# EAGLE design PiHat (EAGLE 9.6.2)
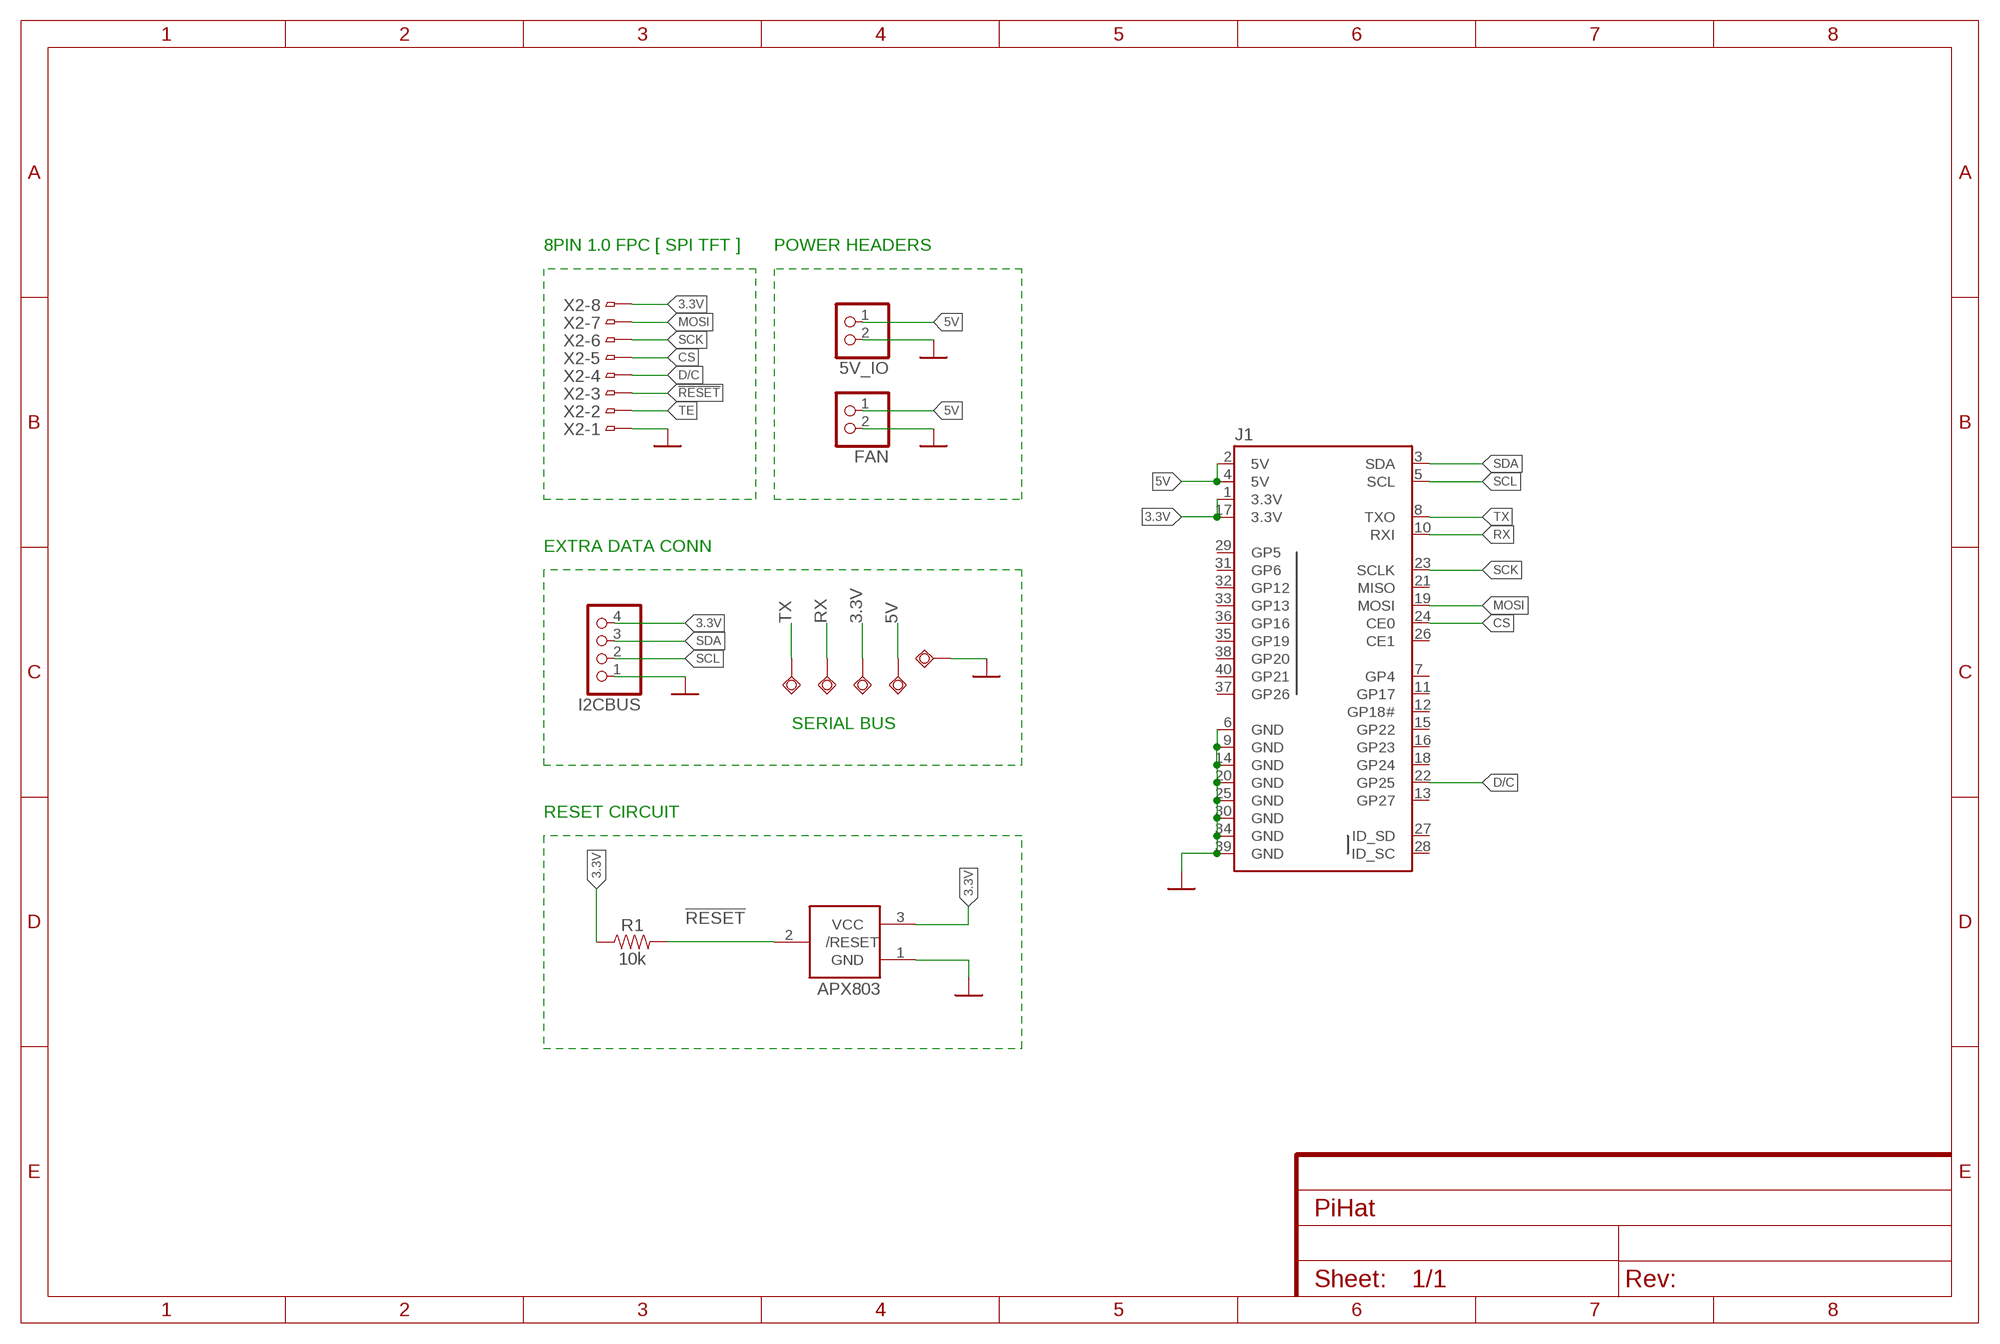
[diagram p0: schematic, sheet 1]

## Parts
5V_IO  ONBOARDCONTROLINTERFACE_LED-BADGE_SCHEMATIC_ADAFRUIT_JST_2PIN-SMT-RA  [ONBOARDCONTROLINTERFACE_LED-BADGE_SCHEMATIC_ADAFRUIT_JST-PH-2-SMT-RA]
APX803  ADAFRUIT_AXP083-SAG  [ADAFRUIT_SOT23]
FAN  ONBOARDCONTROLINTERFACE_LED-BADGE_SCHEMATIC_ADAFRUIT_JST_2PIN-SMT-RA  [ONBOARDCONTROLINTERFACE_LED-BADGE_SCHEMATIC_ADAFRUIT_JST-PH-2-SMT-RA]
I2CBUS  MICROBUILDER_JST_4PIN  [MICROBUILDER_JSTPH4]
J1  DESTINYSENSORFINAL_SPARKFUN-CONNECTORS_RASPBERRYPI-40-PIN-GPIO_PTH_NO_SHROUD  [DESTINYSENSORFINAL_SPARKFUN-CONNECTORS_2X20]
R1  10k  ARDUINO_3V_TTL_INTERFACE_2_PI_SPARKFUN-RESISTORS_10KOHM-0603-1/10W-1%  [ARDUINO_3V_TTL_INTERFACE_2_PI_SPARKFUN-RESISTORS_0603:1]
TP1  DESTINYSENSORFINAL_ARDUINO_3V_TTL_INTERFACE_2_PI_TESTPAD_TPSQTP20SQ  [DESTINYSENSORFINAL_ARDUINO_3V_TTL_INTERFACE_2_PI_TESTPAD_TP20SQ]
TP2  DESTINYSENSORFINAL_ARDUINO_3V_TTL_INTERFACE_2_PI_TESTPAD_TPSQTP20SQ  [DESTINYSENSORFINAL_ARDUINO_3V_TTL_INTERFACE_2_PI_TESTPAD_TP20SQ]
TP3  DESTINYSENSORFINAL_ARDUINO_3V_TTL_INTERFACE_2_PI_TESTPAD_TPSQTP20SQ  [DESTINYSENSORFINAL_ARDUINO_3V_TTL_INTERFACE_2_PI_TESTPAD_TP20SQ]
TP4  DESTINYSENSORFINAL_ARDUINO_3V_TTL_INTERFACE_2_PI_TESTPAD_TPSQTP20SQ  [DESTINYSENSORFINAL_ARDUINO_3V_TTL_INTERFACE_2_PI_TESTPAD_TP20SQ]
TP5  DESTINYSENSORFINAL_ARDUINO_3V_TTL_INTERFACE_2_PI_TESTPAD_TPSQTP20SQ  [DESTINYSENSORFINAL_ARDUINO_3V_TTL_INTERFACE_2_PI_TESTPAD_TP20SQ]
X2  SCREENBREAKOUT_SCREENBREAKOUT_LEDMATRIXFPCCONNECTOR_CON-HIROSE_FH12-08S-1SH  [SCREENBREAKOUT_SCREENBREAKOUT_LEDMATRIXFPCCONNECTOR_CON-HIROSE_FH12-08S-1SH]

## Nets
3.3V: APX803.3(VCC) I2CBUS.4 J1.1(3.3V) J1.17(3.3V) R1.1 TP3.TP X2.8
5V: 5V_IO.1 FAN.1 J1.2(5V) J1.4(5V) TP4.TP
!RESET: APX803.2(/RESET) R1.2 X2.3
CS: J1.24(CE0) X2.5
D/C: J1.22(GP25) X2.4
GND: 5V_IO.2 APX803.1(GND) FAN.2 I2CBUS.1 J1.6(GND) J1.9(GND) J1.14(GND) J1.20(GND) J1.25(GND) J1.30(GND) J1.34(GND) J1.39(GND) TP5.TP X2.1 ; supply symbol labelled 3-5-PIN-SMD_GND
MOSI: J1.19(MOSI) X2.7
RX: J1.10(RXI) TP2.TP
SCK: J1.23(SCLK) X2.6
SCL: I2CBUS.2 J1.5(SCL)
SDA: I2CBUS.3 J1.3(SDA)
TE: X2.2
TX: J1.8(TXO) TP1.TP
Unconnected: J1.7(GP4) J1.11(GP17) J1.12(GP18#) J1.13(GP27) J1.15(GP22) J1.16(GP23) J1.18(GP24) J1.21(MISO) J1.26(CE1) J1.27(ID_SD) J1.28(ID_SC) J1.29(GP5) J1.31(GP6) J1.32(GP12) J1.33(GP13) J1.35(GP19) J1.36(GP16) J1.37(GP26) J1.38(GP20) J1.40(GP21)

## Notes on the sheet
- 8PIN 1.0 FPC [ SPI TFT ] | POWER HEADERS
- EXTRA DATA CONN
- SERIAL BUS
- RESET CIRCUIT

## Library data of the parts
5V_IO FAN = PiHat:ONBOARDCONTROLINTERFACE_LED-BADGE_SCHEMATIC_ADAFRUIT_JST_2PIN: JST 2-Pin Connectors of various flavors SMT-RA (S2B-PH-SM4) 4UConnector #17311 SMT (B2B-PH-SM4) THM-RA (S2B-PH) THM (B2B-PH)
APX803 = PiHat:ADAFRUIT_AXP083
I2CBUS = PiHat:MICROBUILDER_JST_4PIN: JST 4-Pin Right-Angle Connector 4UConnector: 17312
J1 = PiHat:DESTINYSENSORFINAL_SPARKFUN-CONNECTORS_RASPBERRYPI-40-PIN-GPIO: Raspberry Pi GPIO Header 2x20 pin connector, as found on B, B+, A+ models. Both shrouded PTH and SMT versions available. SparkFun Products: GPIO Shrouded Header <https://www.sparkfun.com/products/13054>- PTH SparkFun Pi Wedge (Preassembled) <https://www.sparkfun.com/products/13717>
R1 = PiHat:ARDUINO_3V_TTL_INTERFACE_2_PI_SPARKFUN-RESISTORS_10KOHM: 10kΩ resistor A resistor is a passive two-terminal electrical component that implements electrical resistance as a circuit element. Resistors act to reduce current flow, and, at the same time, act to lower voltage levels within circuits. - Wikipedia; PROD_ID: RES-00824
TP1-TP5 = PiHat:DESTINYSENSORFINAL_ARDUINO_3V_TTL_INTERFACE_2_PI_TESTPAD_TPSQ: Test pad
X2 = PiHat:SCREENBREAKOUT_SCREENBREAKOUT_LEDMATRIXFPCCONNECTOR_CON-HIROSE_FH12-08S-1S: 1mm Pitch Connectors For FPC/FFC Source: Data sheet <http://www.hirose.co.jp/cataloge_hp/e58605370.pdf>; OC_FARNELL: unknown; OC_NEWARK: unknown

## Board
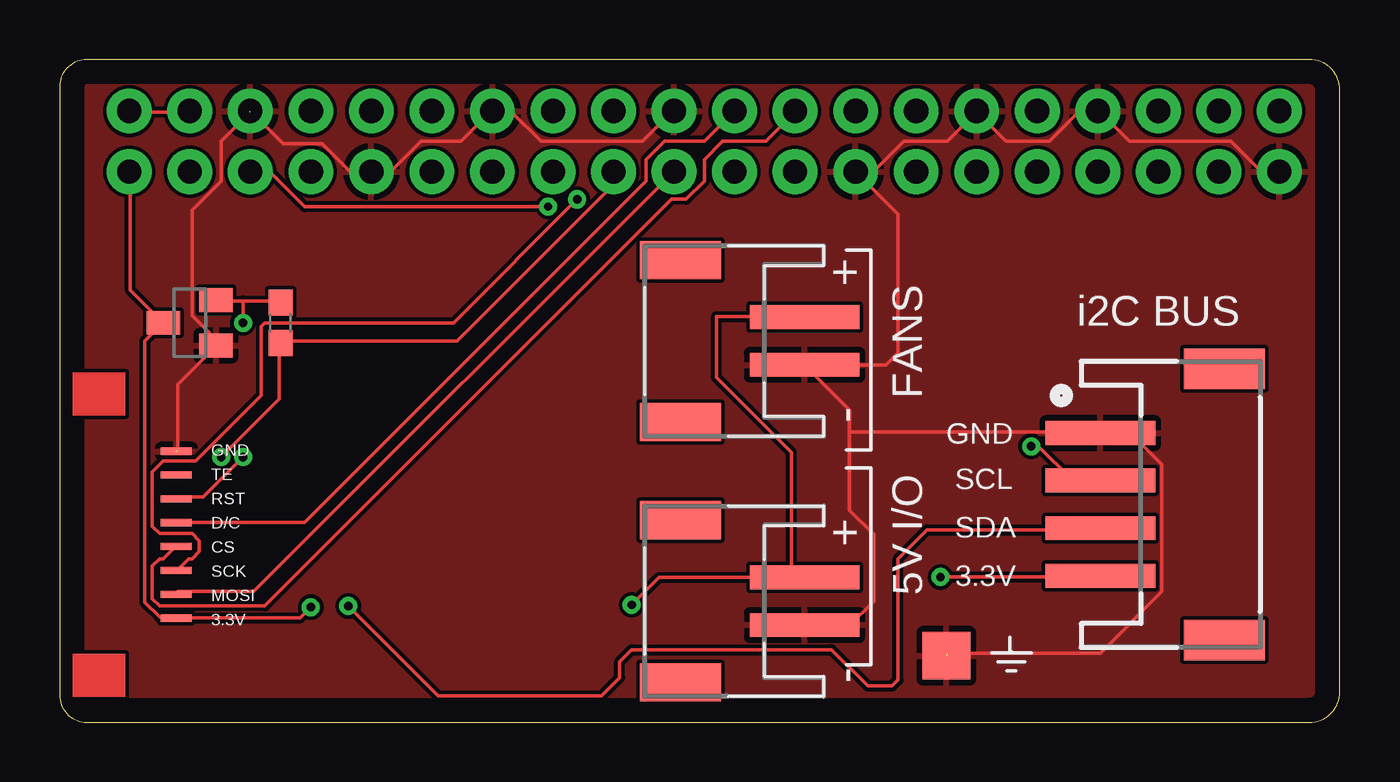
[diagram p1: board, top side]
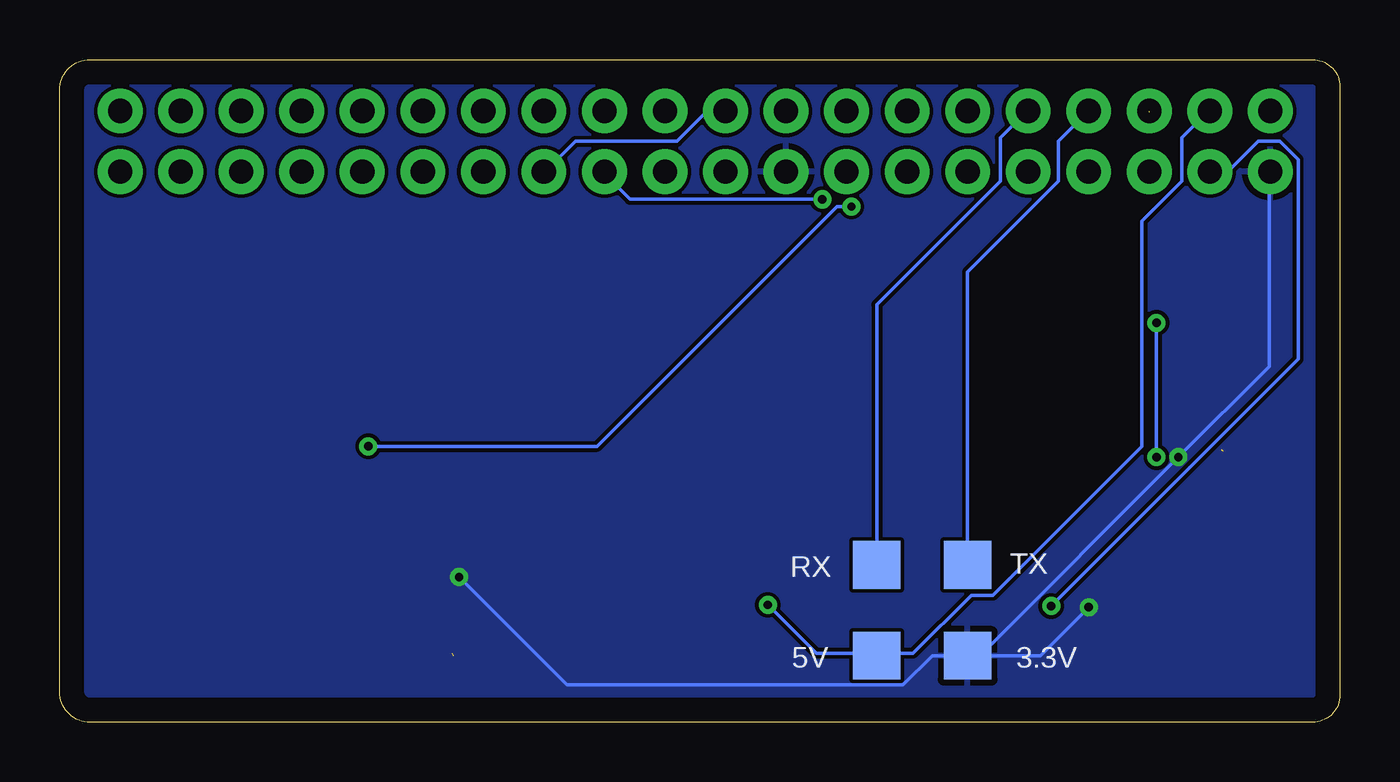
[diagram p2: board, bottom side, seen from below]

Size 53.72 x 27.81 mm. Coordinates in mm from the lower left corner, seen from the top.
Outline: 0,26.67 0,1.14 arc90 1.14,0 52.45,0 52.56,0.01 arc85 53.72,1.27 53.72,26.54 53.72,26.65 arc85 52.45,27.81 1.14,27.81 1.04,27.81 arc85 0,26.67
Copper layers (1*16): Top 0.035mm / dielectric 1.5mm / Bottom 0.035mm
Design rules "default *": minimum track width 6mil, minimum drill 0.35mm, track to track 6mil, track to pad 6mil, pad to pad 6mil, via to via 6mil, smd to smd 6mil, copper to edge 40mil, drill to drill 6mil, minimum pad ring 10mil, minimum via ring 8mil, stop-mask expansion 4mil, vias tented up to drill 0.35mm, thermal gap 10mil

### Footprints (pad centres in the part's own frame; a part is rotated, then mirrored left to right if it is on the bottom)
ONBOARDCONTROLINTERFACE_LED-BADGE_SCHEMATIC_ADAFRUIT_JST-PH-2-SMT-RA = smd 1 x 4.6: 1 1,-3.7; 2 -1,-3.7 | smd 1.6 x 3.4: NC1 -3.4,1.5; NC2 3.4,1.5
ADAFRUIT_SOT23 = smd 1 x 1.4: 1 -0.95,-1.1; 2 0.95,-1.1; 3 0,1.1
MICROBUILDER_JSTPH4 = smd 1 x 4.6: 1 -3,-3.7; 2 -1,-3.7; 3 1,-3.7; 4 3,-3.7 | smd 1.7 x 3.4: NC1 -5.7,1.5; NC2 5.7,1.5
DESTINYSENSORFINAL_SPARKFUN-CONNECTORS_2X20 = drill 1.016 pad 1.88: 1 0,0; 2 0,2.54; 3 2.54,0; 4 2.54,2.54; 5 5.08,0; 6 5.08,2.54; 7 7.62,0; 8 7.62,2.54; 9 10.16,0; 10 10.16,2.54; 11 12.7,0; 12 12.7,2.54; 13 15.24,0; 14 15.24,2.54; 15 17.78,0; 16 17.78,2.54; 17 20.32,0; 18 20.32,2.54; 19 22.86,0; 20 22.86,2.54; 21 25.4,0; 22 25.4,2.54; 23 27.94,0; 24 27.94,2.54; 25 30.48,0; 26 30.48,2.54; 27 33.02,0; 28 33.02,2.54; 29 35.56,0; 30 35.56,2.54; 31 38.1,0; 32 38.1,2.54; 33 40.64,0; 34 40.64,2.54; 35 43.18,0; 36 43.18,2.54; 37 45.72,0; 38 45.72,2.54; 39 48.26,0; 40 48.26,2.54
ARDUINO_3V_TTL_INTERFACE_2_PI_SPARKFUN-RESISTORS_0603:1 = smd 1.1 x 1: 1 -0.85,0; 2 0.85,0
DESTINYSENSORFINAL_ARDUINO_3V_TTL_INTERFACE_2_PI_TESTPAD_TP20SQ = smd 2 x 2: TP 0,0
SCREENBREAKOUT_SCREENBREAKOUT_LEDMATRIXFPCCONNECTOR_CON-HIROSE_FH12-08S-1SH = smd 0.3 x 1.3: 1 -3.5,3.25; 2 -2.5,3.25; 3 -1.5,3.25; 4 -0.5,3.25; 5 0.5,3.25; 6 1.5,3.25; 7 2.5,3.25; 8 3.5,3.25

### Placement (x,y rotation side)
5V_IO  27.56,5.08 90 top
APX803  5.46,16.76 90 top
FAN  27.56,16 90 top
I2CBUS  47.37,9.14 270 top
J1  2.92,23.11 0 top
R1  9.27,16.76 90 top
TP1  15.62,6.6 0 bottom
TP2  19.43,6.6 0 bottom
TP3  15.62,2.79 0 bottom
TP4  19.43,2.79 0 bottom
TP5  37.21,2.79 0 top
X2  1.65,7.87 270 top

### Tracks (layer width: path | path; a pad name or v marks a point on that pad's centre or on a via)
3.3V  (via drill 0.35)
  Top 0.152: J1.17 23.24,22.55 16.69,16 9.37,16 R1.1 9.22,15.85 9.22,13.56 v6.78,11.12 | 4.34,16.76 3.58,16 3.58,5.03 4.19,4.42 4.8,4.42 X2.8 10.09,4.37 v10.54,4.83 | I2CBUS.4 43.66,6.1 v36.96,6.1 | 4.34,16.76 2.97,18.14 2.97,23.01 J1.1 | 4.34,16.76 APX803.3
  Bottom 0.152: TP3.TP 15.62,2.9 15.01,2.9 v6.78,11.12 2.97,14.93 2.97,23.01 J1.1 | TP3.TP 17.11,2.79 18.34,1.56 32.43,1.56 v36.96,6.1 | v10.54,4.83 12.57,2.79 TP3.TP
  pour Bottom: -1.4,27.94 -1.4,0.64 arc90 0.51,-1.27 52.96,-1.27 arc90 55.5,1.27 55.5,26.67 arc90 53.72,28.45 -0.89,28.45 arc90
5V  (via drill 0.35)
  Top 0.152: J1.2 2.97,25.6 5.41,25.6 J1.4 | v24,4.93 25.16,6.08 5V_IO.1 30.71,6.29 30.71,11.33 27.56,14.48 27.56,17.02 31.24,17.02 FAN.1
  Bottom 0.152: 19.43,2.9 17.91,2.9 15.47,5.33 14.55,5.33 8.31,11.58 8.31,21.03 6.63,22.71 6.63,24.54 5.56,25.6 J1.4 | 19.43,2.9 21.97,2.9 v24,4.93 | 19.43,2.9 TP4.TP
!RESET  (via drill 0.35)
  Top 0.152: 7.7,17.68 6.63,17.68 APX803.2 | 7.7,17.68 9.22,17.68 R1.2 | v7.7,11.12 6.02,9.45 4.95,9.45 X2.3 | 7.7,17.68 v7.7,16.76
  Bottom 0.152: v7.7,16.76 v7.7,11.12
CS
  Top 0.152: X2.5 4.8,7.32 4.34,6.86 4.19,6.86 3.89,6.55 3.89,5.18 4.19,4.88 8.61,4.88 25.68,21.95 26.29,21.95 27.05,22.71 27.05,23.62 27.81,24.38 29.64,24.38 30.86,25.6 J1.24
D/C
  Top 0.152: J1.22 27.05,24.38 25.38,24.38 24.61,23.62 24.61,22.71 10.29,8.38 X2.4 4.95,8.38
GND  (3 unrouted)
  Top 0.152: 38.48,25.6 37.26,24.38 35.43,24.38 34.21,23.16 33.45,23.16 J1.25 35.18,21.34 35.18,15.49 34.67,14.99 31.27,14.99 FAN.2 33.15,13.11 33.15,12.19 | 38.48,25.6 39.7,24.38 41.53,24.38 42.75,25.6 43.51,25.6 J1.34 43.66,25.6 44.88,24.38 49.15,24.38 50.37,23.16 51.13,23.16 J1.39 | 38.48,25.6 J1.30 | J1.20 25.68,25.6 24.46,24.38 20.19,24.38 18.97,25.6 18.21,25.6 J1.14 18.06,25.6 16.84,24.38 15.16,24.38 13.89,23.11 J1.9 12.19,23.11 11.03,24.28 9.37,24.28 J1.6 | 4.95,11.43 4.95,14.17 6.48,15.7 APX803.1 6.48,15.85 6.48,16.15 5.56,17.07 5.56,21.49 6.78,22.71 6.78,24.38 8,25.6 | 37.26,2.9 43.66,2.9 46.25,5.49 46.25,10.82 45.03,12.04 43.81,12.04 I2CBUS.1 43.66,12.19 33.15,12.19 | 33.15,12.19 33.15,8.89 34.16,7.87 34.16,5.08 33.15,4.06 31.27,4.06 5V_IO.2
  Bottom 0.152: J1.20 25.83,25.6 26.59,25.6 27.81,24.38 32.08,24.38 33.3,23.16 J1.25
  pour Top: -0.76,27.43 arc-90 -0.64,27.3 -0.64,0.25 arc90 0.25,-0.63 53.21,-0.63 arc90 54.48,0.64 54.48,27.05 arc90 53.09,28.45 0.76,28.45 -0.13,28.45 arc90 -0.76,27.81
MOSI
  Top 0.152: J1.19 8.15,5.49 4.95,5.49 X2.7
RX
  Bottom 0.152: TP2.TP 19.43,17.53 14.25,22.71 14.25,24.54 13.18,25.6 J1.10
SCK  (via drill 0.35)
  Top 0.152: v21.72,21.95 16.54,16.76 8.61,16.76 8.46,16.61 8.46,13.72 5.71,10.97 4.34,10.97 3.89,10.52 3.89,8.23 4.19,7.92 5.56,7.92 5.87,7.62 5.87,7.16 5.56,6.86 5.41,6.86 4.95,6.4 X2.6
  Bottom 0.152: v21.72,21.95 29.79,21.95 30.86,23.01 J1.23
SCL  (via drill 0.35)
  Top 0.152: v20.5,21.64 10.29,21.64 8.92,23.01 8,23.01 J1.5 | v40.77,11.58 41.07,11.58 42.44,10.21 43.66,10.21 I2CBUS.2
  Bottom 0.152: v20.5,21.64 21.11,21.64 31.17,11.58 v40.77,11.58
SDA  (via drill 0.35)
  Top 0.152: I2CBUS.3 43.66,8.08 36.4,8.08 35.18,6.86 35.18,1.78 34.92,1.52 33.91,1.52 32.38,3.05 24,3.05 23.5,2.54 23.5,1.87 22.73,1.1 15.89,1.1 v12.12,4.88
  Bottom 0.152: v12.12,4.88 1.75,15.24 1.75,23.62 2.51,24.38 3.43,24.38 4.65,23.16 5.41,23.16 J1.3
TX
  Bottom 0.152: TP1.TP 15.62,18.9 11.81,22.71 11.81,24.38 J1.8

### Text on the board
tPlace: i2C BUS | FANS | GND | GND | TE | SCL | RST | D/C | SDA | CS | SCK | 3.3V | MOSI | 5V I/O | 3.3V
bPlace: TX | RX | 5V | 3.3V